# Altium schematic sheet [9]-LPDDR4 SDRAM-1.SchDoc: RK3399 SOM Board Design V1.0
size A3; Author: ABC; Organization: Altium Limited; Address1: L3, 12a Rodborough Rd; Address2: Frenchs Forest; Address3: NSW; Address4: Australia 2086; DocumentNumber: 11; SheetNumber: 11; SheetTotal: 21; PROJECT CODE: A_V1.0
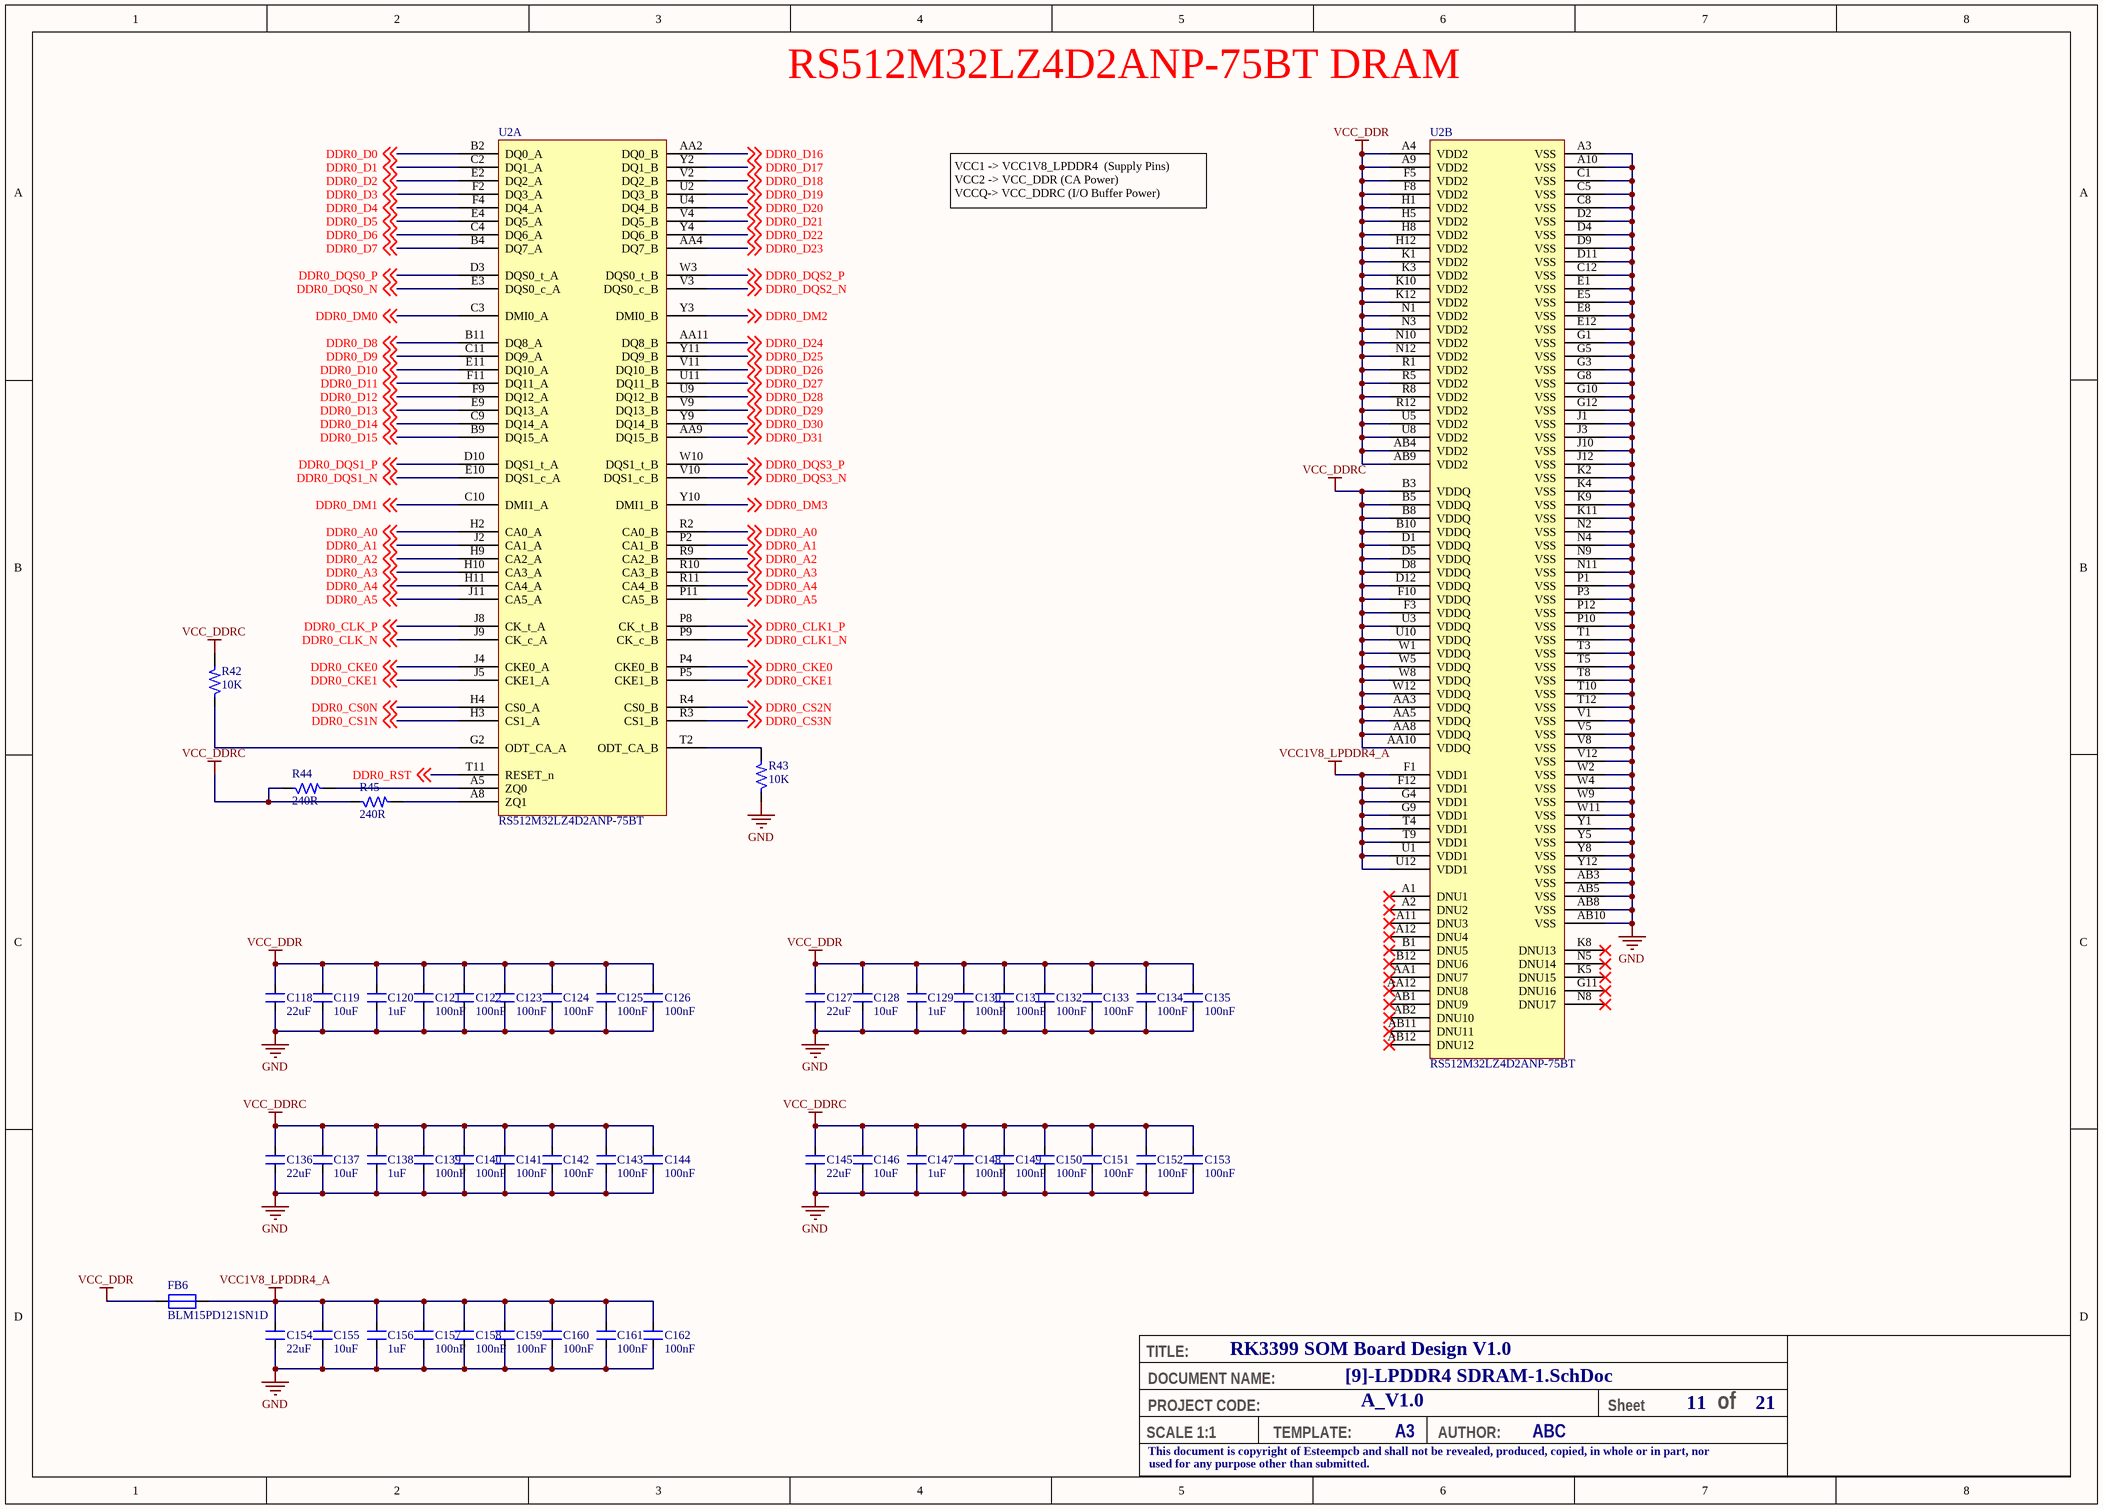
[diagram p0: [9]-LPDDR4 SDRAM-1.SchDoc]

## Parts
C118  22uF  [CAP_0402]
C119  10uF  [CAP_0402]
C120  1uF  [CAP_0201]
C121  100nF  [CAP_0201]
C122  100nF  [CAP_0201]
C123  100nF  [CAP_0201]
C124  100nF  [CAP_0201]
C125  100nF  [CAP_0201]
C126  100nF  [CAP_0201]
C127  22uF  [CAP_0402]
C128  10uF  [CAP_0402]
C129  1uF  [CAP_0201]
C130  100nF  [CAP_0201]
C131  100nF  [CAP_0201]
C132  100nF  [CAP_0201]
C133  100nF  [CAP_0201]
C134  100nF  [CAP_0201]
C135  100nF  [CAP_0201]
C136  22uF  [CAP_0402]
C137  10uF  [CAP_0402]
C138  1uF  [CAP_0201]
C139  100nF  [CAP_0201]
C140  100nF  [CAP_0201]
C141  100nF  [CAP_0201]
C142  100nF  [CAP_0201]
C143  100nF  [CAP_0201]
C144  100nF  [CAP_0201]
C145  22uF  [CAP_0402]
C146  10uF  [CAP_0402]
C147  1uF  [CAP_0201]
C148  100nF  [CAP_0201]
C149  100nF  [CAP_0201]
C150  100nF  [CAP_0201]
C151  100nF  [CAP_0201]
C152  100nF  [CAP_0201]
C153  100nF  [CAP_0201]
C154  22uF  [CAP_0402]
C155  10uF  [CAP_0402]
C156  1uF  [CAP_0201]
C157  100nF  [CAP_0201]
C158  100nF  [CAP_0201]
C159  100nF  [CAP_0201]
C160  100nF  [CAP_0201]
C161  100nF  [CAP_0201]
C162  100nF  [CAP_0201]
FB6  BLM15PD121SN1D  [RES_0402]
R42  10K  [RES_0201]
R43  10K  [RES_0201]
R44  240R  [RES_0201]
R45  240R  [RES_0201]
U2  RS512M32LZ4D2ANP-75BT  [FBGA200_SMD]  (parts A,B of 2)

## Nets
GND: C118.1 C119.1 C120.1 C121.1 C122.1 C123.1 C124.1 C125.1 C126.1 C127.1 C128.1 C129.1 C130.1 C131.1 C132.1 C133.1 C134.1 C135.1 C136.1 C137.1 C138.1 C139.1 C140.1 C141.1 C142.1 C143.1 C144.1 C145.1 C146.1 C147.1 C148.1 C149.1 C150.1 C151.1 C152.1 C153.1 C154.1 C155.1 C156.1 C157.1 C158.1 C159.1 C160.1 C161.1 C162.1 R43.1 U2.A3(VSS) U2.A10(VSS) U2.AB3(VSS) U2.AB5(VSS) U2.AB8(VSS) U2.AB10(VSS) U2.C1(VSS) U2.C5(VSS) U2.C8(VSS) U2.C12(VSS) U2.D2(VSS) U2.D4(VSS) U2.D9(VSS) U2.D11(VSS) U2.E1(VSS) U2.E5(VSS) U2.E8(VSS) U2.E12(VSS) U2.G1(VSS) U2.G3(VSS) U2.G5(VSS) U2.G8(VSS) U2.G10(VSS) U2.G12(VSS) U2.J1(VSS) U2.J3(VSS) U2.J10(VSS) U2.J12(VSS) U2.K2(VSS) U2.K4(VSS) U2.K9(VSS) U2.K11(VSS) U2.N2(VSS) U2.N4(VSS) U2.N9(VSS) U2.N11(VSS) U2.P1(VSS) U2.P3(VSS) U2.P10(VSS) U2.P12(VSS) U2.T1(VSS) U2.T3(VSS) U2.T5(VSS) U2.T8(VSS) U2.T10(VSS) U2.T12(VSS) U2.V1(VSS) U2.V5(VSS) U2.V8(VSS) U2.V12(VSS) U2.W2(VSS) U2.W4(VSS) U2.W9(VSS) U2.W11(VSS) U2.Y1(VSS) U2.Y5(VSS) U2.Y8(VSS) U2.Y12(VSS)
VCC1V8_LPDDR4_A: C154.2 C155.2 C156.2 C157.2 C158.2 C159.2 C160.2 C161.2 C162.2 FB6.2 U2.F1(VDD1) U2.F12(VDD1) U2.G4(VDD1) U2.G9(VDD1) U2.T4(VDD1) U2.T9(VDD1) U2.U1(VDD1) U2.U12(VDD1)
VCC_DDR: C118.2 C119.2 C120.2 C121.2 C122.2 C123.2 C124.2 C125.2 C126.2 C127.2 C128.2 C129.2 C130.2 C131.2 C132.2 C133.2 C134.2 C135.2 FB6.1 U2.A4(VDD2) U2.A9(VDD2) U2.AB4(VDD2) U2.AB9(VDD2) U2.F5(VDD2) U2.F8(VDD2) U2.H1(VDD2) U2.H5(VDD2) U2.H8(VDD2) U2.H12(VDD2) U2.K1(VDD2) U2.K3(VDD2) U2.K10(VDD2) U2.K12(VDD2) U2.N1(VDD2) U2.N3(VDD2) U2.N10(VDD2) U2.N12(VDD2) U2.R1(VDD2) U2.R5(VDD2) U2.R8(VDD2) U2.R12(VDD2) U2.U5(VDD2) U2.U8(VDD2)
VCC_DDRC: C136.2 C137.2 C138.2 C139.2 C140.2 C141.2 C142.2 C143.2 C144.2 C145.2 C146.2 C147.2 C148.2 C149.2 C150.2 C151.2 C152.2 C153.2 R42.2 R44.1 R45.1 U2.AA3(VDDQ) U2.AA5(VDDQ) U2.AA8(VDDQ) U2.AA10(VDDQ) U2.B3(VDDQ) U2.B5(VDDQ) U2.B8(VDDQ) U2.B10(VDDQ) U2.D1(VDDQ) U2.D5(VDDQ) U2.D8(VDDQ) U2.D12(VDDQ) U2.F3(VDDQ) U2.F10(VDDQ) U2.U3(VDDQ) U2.U10(VDDQ) U2.W1(VDDQ) U2.W5(VDDQ) U2.W8(VDDQ) U2.W12(VDDQ)
DDR0_A0: U2.H2(CA0_A) U2.R2(CA0_B) ; off-sheet DDR0_A0
DDR0_A1: U2.J2(CA1_A) U2.P2(CA1_B) ; off-sheet DDR0_A1
DDR0_A2: U2.H9(CA2_A) U2.R9(CA2_B) ; off-sheet DDR0_A2
DDR0_A3: U2.H10(CA3_A) U2.R10(CA3_B) ; off-sheet DDR0_A3
DDR0_A4: U2.H11(CA4_A) U2.R11(CA4_B) ; off-sheet DDR0_A4
DDR0_A5: U2.J11(CA5_A) U2.P11(CA5_B) ; off-sheet DDR0_A5
DDR0_CKE0: U2.J4(CKE0_A) U2.P4(CKE0_B) ; off-sheet DDR0_CKE0
DDR0_CKE1: U2.J5(CKE1_A) U2.P5(CKE1_B) ; off-sheet DDR0_CKE1
DDR0_CLK1_N: U2.P9(CK_c_B) ; off-sheet DDR0_CLK1_N
DDR0_CLK1_P: U2.P8(CK_t_B) ; off-sheet DDR0_CLK1_P
DDR0_CLK_N: U2.J9(CK_c_A) ; off-sheet DDR0_CLK_N
DDR0_CLK_P: U2.J8(CK_t_A) ; off-sheet DDR0_CLK_P
DDR0_CS0N: U2.H4(CS0_A) ; off-sheet DDR0_CS0N
DDR0_CS1N: U2.H3(CS1_A) ; off-sheet DDR0_CS1N
DDR0_CS2N: U2.R4(CS0_B) ; off-sheet DDR0_CS2N
DDR0_CS3N: U2.R3(CS1_B) ; off-sheet DDR0_CS3N
DDR0_D0: U2.B2(DQ0_A) ; off-sheet DDR0_D0
DDR0_D1: U2.C2(DQ1_A) ; off-sheet DDR0_D1
DDR0_D2: U2.E2(DQ2_A) ; off-sheet DDR0_D2
DDR0_D3: U2.F2(DQ3_A) ; off-sheet DDR0_D3
DDR0_D4: U2.F4(DQ4_A) ; off-sheet DDR0_D4
DDR0_D5: U2.E4(DQ5_A) ; off-sheet DDR0_D5
DDR0_D6: U2.C4(DQ6_A) ; off-sheet DDR0_D6
DDR0_D7: U2.B4(DQ7_A) ; off-sheet DDR0_D7
DDR0_D8: U2.B11(DQ8_A) ; off-sheet DDR0_D8
DDR0_D9: U2.C11(DQ9_A) ; off-sheet DDR0_D9
DDR0_D10: U2.E11(DQ10_A) ; off-sheet DDR0_D10
DDR0_D11: U2.F11(DQ11_A) ; off-sheet DDR0_D11
DDR0_D12: U2.F9(DQ12_A) ; off-sheet DDR0_D12
DDR0_D13: U2.E9(DQ13_A) ; off-sheet DDR0_D13
DDR0_D14: U2.C9(DQ14_A) ; off-sheet DDR0_D14
DDR0_D15: U2.B9(DQ15_A) ; off-sheet DDR0_D15
DDR0_D16: U2.AA2(DQ0_B) ; off-sheet DDR0_D16
DDR0_D17: U2.Y2(DQ1_B) ; off-sheet DDR0_D17
DDR0_D18: U2.V2(DQ2_B) ; off-sheet DDR0_D18
DDR0_D19: U2.U2(DQ3_B) ; off-sheet DDR0_D19
DDR0_D20: U2.U4(DQ4_B) ; off-sheet DDR0_D20
DDR0_D21: U2.V4(DQ5_B) ; off-sheet DDR0_D21
DDR0_D22: U2.Y4(DQ6_B) ; off-sheet DDR0_D22
DDR0_D23: U2.AA4(DQ7_B) ; off-sheet DDR0_D23
DDR0_D24: U2.AA11(DQ8_B) ; off-sheet DDR0_D24
DDR0_D25: U2.Y11(DQ9_B) ; off-sheet DDR0_D25
DDR0_D26: U2.V11(DQ10_B) ; off-sheet DDR0_D26
DDR0_D27: U2.U11(DQ11_B) ; off-sheet DDR0_D27
DDR0_D28: U2.U9(DQ12_B) ; off-sheet DDR0_D28
DDR0_D29: U2.V9(DQ13_B) ; off-sheet DDR0_D29
DDR0_D30: U2.Y9(DQ14_B) ; off-sheet DDR0_D30
DDR0_D31: U2.AA9(DQ15_B) ; off-sheet DDR0_D31
DDR0_DM0: U2.C3(DMI0_A) ; off-sheet DDR0_DM0
DDR0_DM1: U2.C10(DMI1_A) ; off-sheet DDR0_DM1
DDR0_DM2: U2.Y3(DMI0_B) ; off-sheet DDR0_DM2
DDR0_DM3: U2.Y10(DMI1_B) ; off-sheet DDR0_DM3
DDR0_DQS0_N: U2.E3(DQS0_c_A) ; off-sheet DDR0_DQS0_N
DDR0_DQS0_P: U2.D3(DQS0_t_A) ; off-sheet DDR0_DQS0_P
DDR0_DQS1_N: U2.E10(DQS1_c_A) ; off-sheet DDR0_DQS1_N
DDR0_DQS1_P: U2.D10(DQS1_t_A) ; off-sheet DDR0_DQS1_P
DDR0_DQS2_N: U2.V3(DQS0_c_B) ; off-sheet DDR0_DQS2_N
DDR0_DQS2_P: U2.W3(DQS0_t_B) ; off-sheet DDR0_DQS2_P
DDR0_DQS3_N: U2.V10(DQS1_c_B) ; off-sheet DDR0_DQS3_N
DDR0_DQS3_P: U2.W10(DQS1_t_B) ; off-sheet DDR0_DQS3_P
DDR0_RST: U2.T11(RESET_n) ; off-sheet DDR0_RST
NetR42_1: R42.1 U2.G2(ODT_CA_A)
NetR43_2: R43.2 U2.T2(ODT_CA_B)
NetR44_2: R44.2 U2.A5(ZQ0)
NetR45_2: R45.2 U2.A8(ZQ1)

Not connected (* = marked no-connect by the designer): U2 A1(DNU1)* A2(DNU2)* A11(DNU3)* A12(DNU4)* AA1(DNU7)* AA12(DNU8)* AB1(DNU9)* AB2(DNU10)* AB11(DNU11)* AB12(DNU12)* B1(DNU5)* B12(DNU6)* G11(DNU16)* K5(DNU15)* K8(DNU13)* N5(DNU14)* N8(DNU17)*

## Notes on the sheet
- RS512M32LZ4D2ANP-75BT DRAM
- VCC1 -> VCC1V8_LPDDR4  (Supply Pins)
  VCC2 -> VCC_DDR (CA Power)
  VCCQ-> VCC_DDRC (I/O Buffer Power)
- TITLE:
- DOCUMENT NAME:
- SCALE 1:1
- This document is copyright of Esteempcb and shall not be revealed, produced, copied, in whole or in part, nor
- PROJECT CODE:
- TEMPLATE:
- A3
- AUTHOR:
- Sheet
- of
- used for any purpose other than submitted.

## Library data of the parts
C118 C127 C136 C145 C154 = CAP_22uF-6.3V-20%-0402: 22µF ±20% 6.3V Ceramic Capacitor X5R 0402 (1005 Metric) /; Manufacturer: Murata Electronics; Manufacturer Part Number: CL05A226MQ5N6J8; Case/Package: 0402; Supplier-1: Digikey
C119 C128 C137 C146 C155 = CAP_10uF-10V-20%-0402: 10µF ±20% 10V Ceramic Capacitor X5R 0402 (1005 Metric) /; Manufacturer Part Number: CL05A106MP5NUNC; Manufacturer: Samsung Electro-Mechanics; Case/Package: 0402; Supplier-1: Digikey
C120 C129 C138 C147 C156 = CAP_1uF-16V-10%-0201: 1µF ±20% 16V Ceramic Capacitor X5R 0201 (0603 Metric) /; Manufacturer: Samsung Electro-Mechanics; Manufacturer Part Number: CL03A105MO3NRNH; Case/Package: 0201; Supplier-1: Digikey
C121-C126 C130-C135 C139-C144 C148-C153 C157-C162 = CAP_100nF-25V-10%-0201: 0.1µF ±10% 25V Ceramic Capacitor X5R 0201 (0603 Metric) /; Manufacturer: TDK Corporation; Manufacturer Part Number: C0603X5R1E104K030BB; Case/Package: 0201; Supplier-1: Digikey
FB6 = FB_120R-1.3A-100Mhz-0402: 120 Ohms @ 100MHz 1 Power Line Ferrite Bead 0402 (1005 Metric) 1.3A 90mOhm; Manufacturer: Murata Electronics; Mnaufacturer Part Number: BLM15PD121SN1D; Case/Package: 0402; Supplier-1: Digikey
R42 R43 = RES_10K-0.05W-1%-0201: 10 kOhms ±1% 0.05W, 1/20W Chip Resistor 0201 (0603 Metric) Thick Film /; Manufacturer: Stackpole Electronics Inc; Manufacturer Part Number: RMCF0201FT10K0; Case/Package: 0201; Supplier-1: Digikey
R44 R45 = RES_240R-0.05W-1%-0201: 240 Ohms ±1% 0.05W, 1/20W Chip Resistor 0201 (0603 Metric) Thick Film /; Manufacturer: Yageo; Manufacturer Part Number: RC0201FR-07240RL; Case/Package: 0201; Supplier-1: Digikey
U2 = IC_RS512M32LZ4D2ANP-75BT: LPDDR4/4X Package FBGA 200b Density 4Gbit~64Gbit Operating Temperature Range：-25~85℃ Speed：2667Mbps/3200Mbps/3733Mbps Voltage：VDD1/VDD2/VDDQ= 1.8 / 1.1 / 1.1 V（LPDDR4）VDD1/VDD2/VDDQ = 1.8 / 1.1 / 0.6 V（LPDDR4X）Approved Verification Platform：MTK、Spreadtrum; Manufacturer: RAYSON; Manufacturer Part Number: RS512M32LZ4D2ANP-75BT; Case/Package: FBGA 200b; Supplier-1: RAYSON